# Altium schematic sheet indicator.SchDoc
size A3
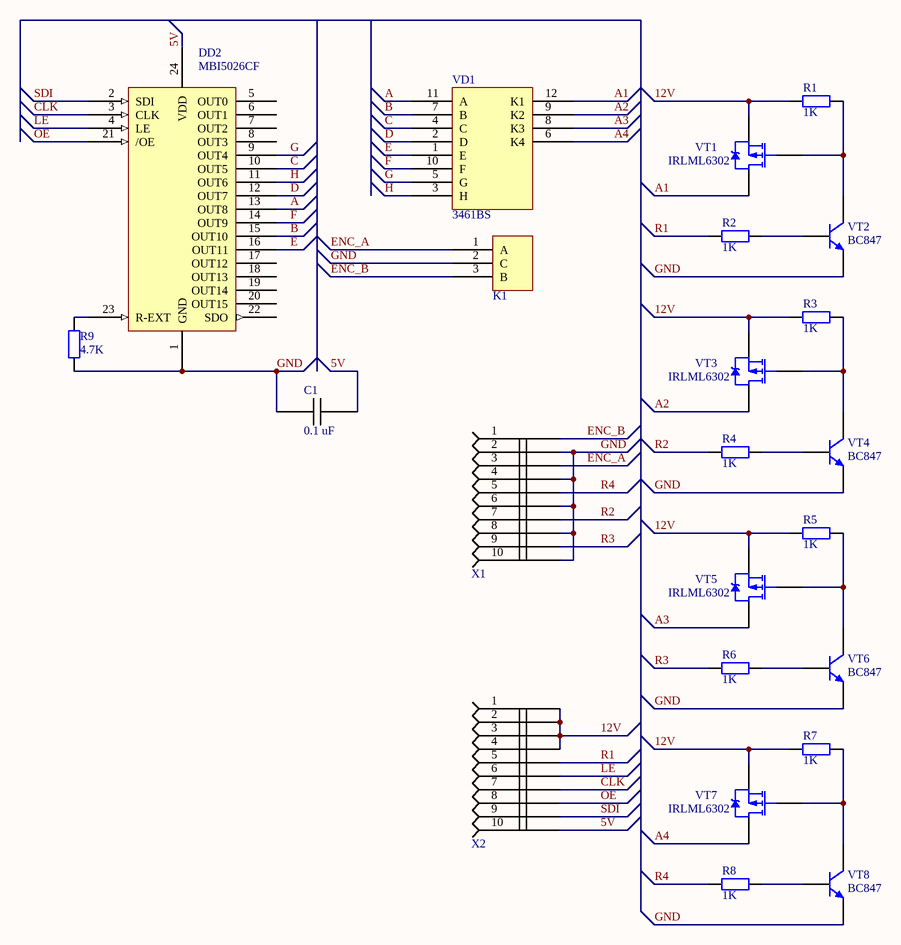
[diagram p0: indicator.SchDoc]

## Parts
C1  0.1 uF  [R1206]
DD2  MBI5026CF  [SOP24]
K1  EC12  [EC12E1220406]  (value not drawn)
R1  1K  [R1206]
R2  1K  [R1206]
R3  1K  [R1206]
R4  1K  [R1206]
R5  1K  [R1206]
R6  1K  [R1206]
R7  1K  [R1206]
R8  1K  [R1206]
R9  4.7K  [R1206]
VD1  3461BS  [3461bs]
VT1  IRLML6302  [SOT-23_N]
VT2  BC847  [SOT23_N]
VT3  IRLML6302  [SOT-23_N]
VT4  BC847  [SOT23_N]
VT5  IRLML6302  [SOT-23_N]
VT6  BC847  [SOT23_N]
VT7  IRLML6302  [SOT-23_N]
VT8  BC847  [SOT23_N]
X1  PBS-10  [PBS-10]  (value not drawn)
X2  PBS-10  [PBS-10]  (value not drawn)

## Nets
5V: C1.1 DD2.24(VDD) X2.10
12V: R1.2 R3.2 R5.2 R7.2 VT1.2(S) VT3.2(S) VT5.2(S) VT7.2(S) X2.1 X2.2 X2.3 X2.4
A: DD2.13(OUT8) VD1.11(A)
A1: VD1.12(K1) VT1.3(D)
A2: VD1.9(K2) VT3.3(D)
A3: VD1.8(K3) VT5.3(D)
A4: VD1.6(K4) VT7.3(D)
B: DD2.15(OUT10) VD1.7(B)
C: DD2.10(OUT5) VD1.4(C)
CLK: DD2.3(CLK) X2.7
D: DD2.12(OUT7) VD1.2(D)
E: DD2.16(OUT11) VD1.1(E)
ENC_A: K1.1(A) X1.3
ENC_B: K1.3(B) X1.1
F: DD2.14(OUT9) VD1.10(F)
G: DD2.9(OUT4) VD1.5(G)
GND: C1.2 DD2.1(GND) K1.2(C) R9.1 VT2.2(E) VT4.2(E) VT6.2(E) VT8.2(E) X1.2 X1.4 X1.6 X1.8 X1.10
H: DD2.11(OUT6) VD1.3(H)
LE: DD2.4(LE) X2.6
OE: DD2.21(/OE) X2.8
R1: R2.2 X2.5
R2: R4.2 X1.7
R3: R6.2 X1.9
R4: R8.2 X1.5
SDI: DD2.2(SDI) X2.9
NetDD2_23: DD2.23(R-EXT) R9.2
NetR1_1: R1.1 VT1.1(G) VT2.3(C)
NetR2_1: R2.1 VT2.1(B)
NetR3_1: R3.1 VT3.1(G) VT4.3(C)
NetR4_1: R4.1 VT4.1(B)
NetR5_1: R5.1 VT5.1(G) VT6.3(C)
NetR6_1: R6.1 VT6.1(B)
NetR7_1: R7.1 VT7.1(G) VT8.3(C)
NetR8_1: R8.1 VT8.1(B)

Not connected (* = marked no-connect by the designer): DD2 5(OUT0) 6(OUT1) 7(OUT2) 8(OUT3) 17(OUT12) 18(OUT13) 19(OUT14) 20(OUT15) 22(SDO)

## Library data of the parts
C1 = CAP_1206
K1 = EC12E1220406
R1-R9 = Res
VT1 VT3 VT5 VT7 = IRLML6302: HEXFET Power MOSFET; Published: 8-Jun-2000; LatestRevisionDate: 20-Nov-2009; LatestRevisionNote: IPC-7351 Footprint Added.; DatasheetVersion: Aug-1997; PackageReference: SOT-23; Publisher: Altium Limited; PackageDescription: 3-Pin SOT-23 Package 0.95 mm Pitch, 2.3 mm Lead Span; ComponentLink1Description: Manufacturer Link; ComponentLink1URL: http://www.irf.com/; ComponentLink2Description: Datasheet; ComponentLink2URL: http://www.irf.com/product-info/datasheets/data/irlml6302.pdf
VT2 VT4 VT6 VT8 = BC847: NPN General-purpose Transistor; Published: 17-Sep-2003; LatestRevisionDate: 12-Dec-2006; LatestRevisionNote: IPC-7351 Footprint Added.; DatasheetVersion: 4-Feb-2002; PackageVersion: May-1999; PackageReference: SOT23; Publisher: Altium Limited; PackageDescription: 3-Pin SOT-23 Package 0.95 mm Pitch, 2.3 mm Lead Span; ComponentLink1Description: Manufacturer Link; ComponentLink1URL: http://www.semiconductors.philips.com/; ComponentLink2Description: Datasheet; ComponentLink2URL: http://www.semiconductors.philips.com/acrobat/datasheets/BC846_BC847_BC848_5.pdf